# EAGLE design Porsche Quad Gauge (EAGLE 6.4)
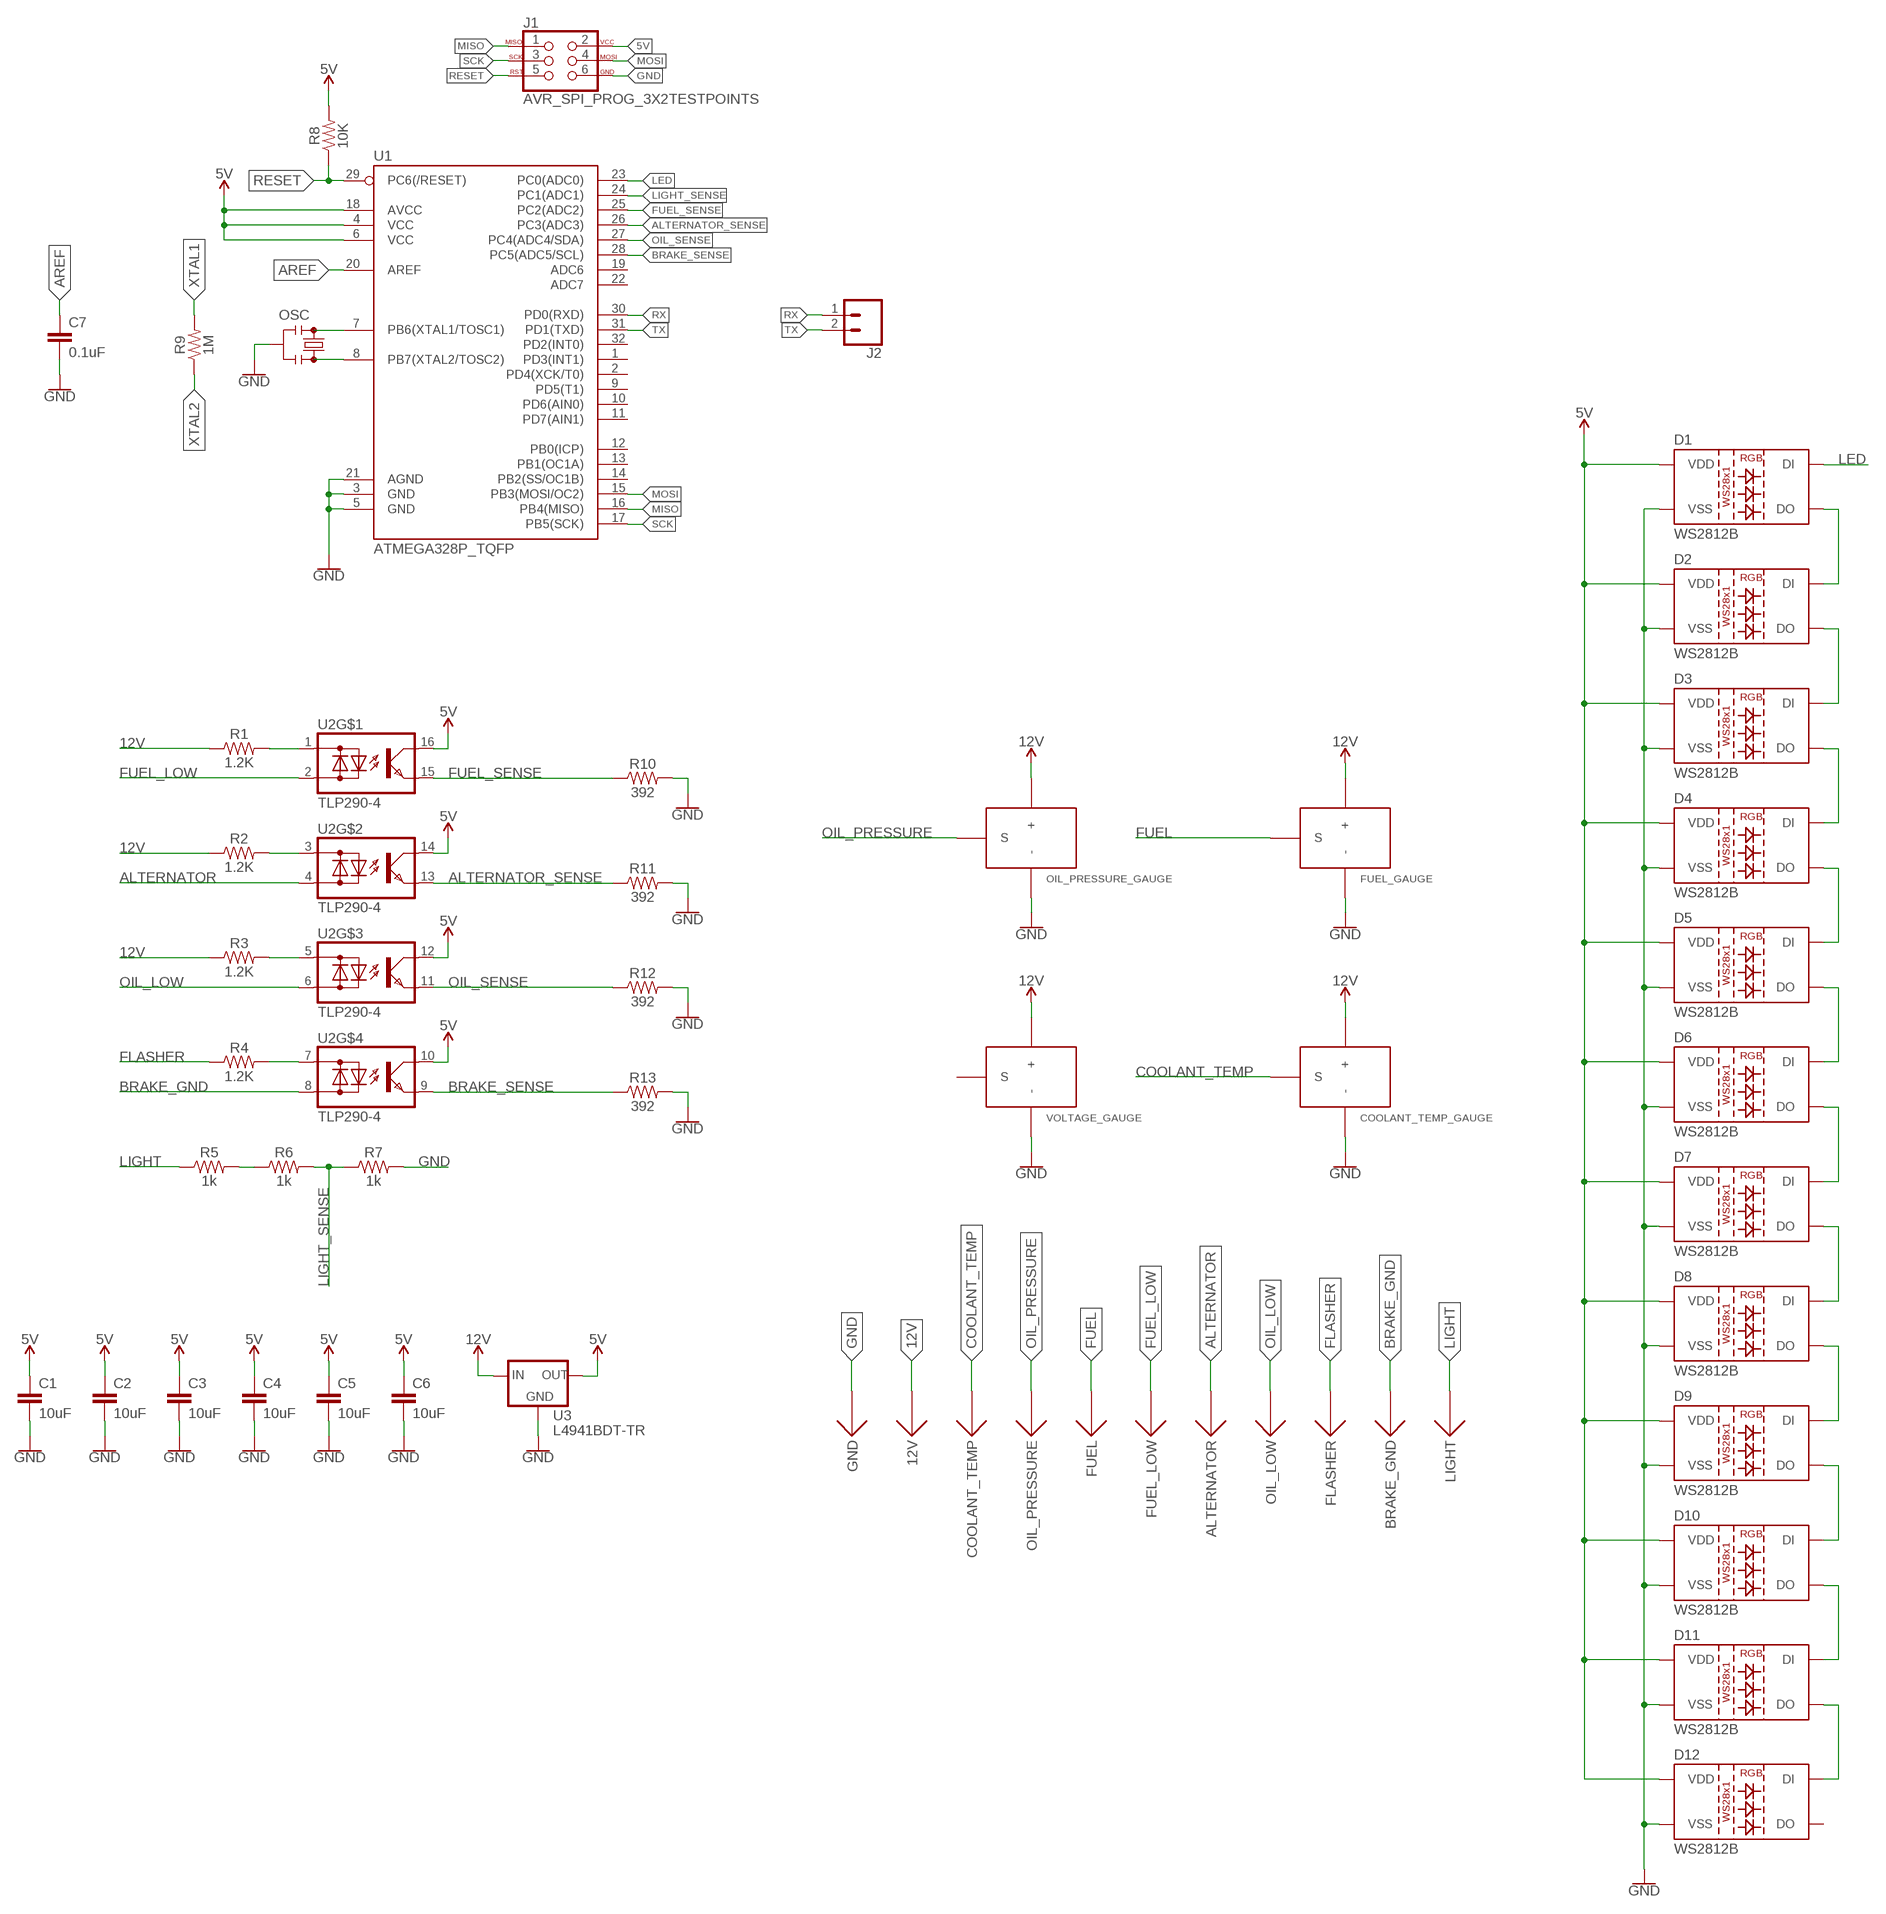
[diagram p0: schematic, sheet 1]

## Parts
12V  CONNECTOR_QC_TAB_0.25  [CONNECTOR_QC_TAB-0.25]
ALTERNATOR  CONNECTOR_QC_TAB_0.25  [CONNECTOR_QC_TAB-0.25]
BRAKE_GND  CONNECTOR_QC_TAB_0.25  [CONNECTOR_QC_TAB-0.25]
C1  10uF  10UF-0805-10V-10%  [0805]
C2  10uF  10UF-0805-10V-10%  [0805]
C3  10uF  10UF-0805-10V-10%  [0805]
C4  10uF  10UF-0805-10V-10%  [0805]
C5  10uF  10UF-0805-10V-10%  [0805]
C6  10uF  10UF-0805-10V-10%  [0805]
C7  0.1uF  10UF-0805-10V-10%  [0805]
COOLANT_TEMP  CONNECTOR_QC_TAB_0.25  [CONNECTOR_QC_TAB-0.25]
COOLANT_TEMP_GAUGE  VDO_OLD  [VDO_GAUGE_SOCKET]
D1  WS2812B  [WS2812B]
D2  WS2812B  [WS2812B]
D3  WS2812B  [WS2812B]
D4  WS2812B  [WS2812B]
D5  WS2812B  [WS2812B]
D6  WS2812B  [WS2812B]
D7  WS2812B  [WS2812B]
D8  WS2812B  [WS2812B]
D9  WS2812B  [WS2812B]
D10  WS2812B  [WS2812B]
D11  WS2812B  [WS2812B]
D12  WS2812B  [WS2812B]
FLASHER  CONNECTOR_QC_TAB_0.25  [CONNECTOR_QC_TAB-0.25]
FUEL  CONNECTOR_QC_TAB_0.25  [CONNECTOR_QC_TAB-0.25]
FUEL_GAUGE  VDO_OLD  [VDO_GAUGE_SOCKET]
FUEL_LOW  CONNECTOR_QC_TAB_0.25  [CONNECTOR_QC_TAB-0.25]
GND  CONNECTOR_QC_TAB_0.25  [CONNECTOR_QC_TAB-0.25]
J1  AVR_SPI_PROG_3X2TESTPOINTS  [2X3_TEST_POINTS]
J2  CONN_02  [1X02]
LIGHT  CONNECTOR_QC_TAB_0.25  [CONNECTOR_QC_TAB-0.25]
OIL_LOW  CONNECTOR_QC_TAB_0.25  [CONNECTOR_QC_TAB-0.25]
OIL_PRESSURE  CONNECTOR_QC_TAB_0.25  [CONNECTOR_QC_TAB-0.25]
OIL_PRESSURE_GAUGE  VDO_NEW  [VDO_NEW_GAUGE_SOCKET]
OSC  PRQC16.00SR1010V00L  [3-SMD]
R1  1.2K  RESISTOR0805  [0805]
R2  1.2K  RESISTOR0805  [0805]
R3  1.2K  RESISTOR0805  [0805]
R4  1.2K  RESISTOR0805  [0805]
R5  1k  RESISTOR0805  [0805]
R6  1k  RESISTOR0805  [0805]
R7  1k  RESISTOR0805  [0805]
R8  10K  RESISTOR0805  [0805]
R9  1M  RESISTOR0805  [0805]
R10  392  RESISTOR0805  [0805]
R11  392  RESISTOR0805  [0805]
R12  392  RESISTOR0805  [0805]
R13  392  RESISTOR0805  [0805]
U1  ATMEGA328P_TQFP  [TQFP32-08]
U2  TLP290-4  [SO16]
U3  L4941BDT-TR  [D-PAK_TO252AA]
VOLTAGE_GAUGE  VDO_NEW  [VDO_NEW_GAUGE_SOCKET]

## Nets
5V: C1.1 C2.1 C3.1 C4.1 C5.1 C6.1 D1.1(VDD) D2.1(VDD) D3.1(VDD) D4.1(VDD) D5.1(VDD) D6.1(VDD) D7.1(VDD) D8.1(VDD) D9.1(VDD) D10.1(VDD) D11.1(VDD) D12.1(VDD) J1.2 R8.2 U1.4(VCC) U1.6(VCC) U1.18(AVCC) U2.10(C) U2.12(C) U2.14(C) U2.16(C) U3.3(OUT)
12V: 12V.S1(SIGNAL) 12V.S2(SIGNAL) COOLANT_TEMP_GAUGE.12V(+) FUEL_GAUGE.12V(+) OIL_PRESSURE_GAUGE.12V(+) R1.1 R2.1 R3.1 U3.1(IN) VOLTAGE_GAUGE.12V(+)
ALTERNATOR: ALTERNATOR.S1(SIGNAL) ALTERNATOR.S2(SIGNAL) U2.4(AC2)
ALTERNATOR_SENSE: R11.1 U1.26(PC3(ADC3)) U2.13(E)
AREF: C7.1 U1.20(AREF)
BRAKE_GND: BRAKE_GND.S1(SIGNAL) BRAKE_GND.S2(SIGNAL) U2.8(AC2)
BRAKE_SENSE: R13.1 U1.28(PC5(ADC5/SCL)) U2.9(E)
COOLANT_TEMP: COOLANT_TEMP.S1(SIGNAL) COOLANT_TEMP.S2(SIGNAL) COOLANT_TEMP_GAUGE.SIGNAL(S)
FLASHER: FLASHER.S1(SIGNAL) FLASHER.S2(SIGNAL) R4.1
FUEL: FUEL.S1(SIGNAL) FUEL.S2(SIGNAL) FUEL_GAUGE.SIGNAL(S)
FUEL_LOW: FUEL_LOW.S1(SIGNAL) FUEL_LOW.S2(SIGNAL) U2.2(AC2)
FUEL_SENSE: R10.1 U1.25(PC2(ADC2)) U2.15(E)
GND: C1.2 C2.2 C3.2 C4.2 C5.2 C6.2 C7.2 COOLANT_TEMP_GAUGE.GND(-) D1.3(VSS) D2.3(VSS) D3.3(VSS) D4.3(VSS) D5.3(VSS) D6.3(VSS) D7.3(VSS) D8.3(VSS) D9.3(VSS) D10.3(VSS) D11.3(VSS) D12.3(VSS) FUEL_GAUGE.GND(-) GND.S1(SIGNAL) GND.S2(SIGNAL) J1.6 OIL_PRESSURE_GAUGE.GND(-) OSC.GND R7.2 R10.2 R11.2 R12.2 R13.2 U1.3(GND) U1.5(GND) U1.21(AGND) U3.2(GND) VOLTAGE_GAUGE.GND(-)
LED: D1.4(DI) U1.23(PC0(ADC0))
LIGHT: LIGHT.S1(SIGNAL) LIGHT.S2(SIGNAL) R5.1
LIGHT_SENSE: R6.2 R7.1 U1.24(PC1(ADC1))
MISO: J1.1 U1.16(PB4(MISO))
MOSI: J1.4 U1.15(PB3(MOSI/OC2))
N$1: R1.2 U2.1(AC1)
N$3: R5.2 R6.1
N$5: R2.2 U2.3(AC1)
N$8: D1.2(DO) D2.4(DI)
N$9: D2.2(DO) D3.4(DI)
N$10: D3.2(DO) D4.4(DI)
N$11: D4.2(DO) D5.4(DI)
N$12: D5.2(DO) D6.4(DI)
N$13: D6.2(DO) D7.4(DI)
N$14: D7.2(DO) D8.4(DI)
N$15: D8.2(DO) D9.4(DI)
N$16: D9.2(DO) D10.4(DI)
N$17: D10.2(DO) D11.4(DI)
N$18: D11.2(DO) D12.4(DI)
N$21: R3.2 U2.5(AC1)
N$22: R4.2 U2.7(AC1)
OIL_LOW: OIL_LOW.S1(SIGNAL) OIL_LOW.S2(SIGNAL) U2.6(AC2)
OIL_PRESSURE: OIL_PRESSURE.S1(SIGNAL) OIL_PRESSURE.S2(SIGNAL) OIL_PRESSURE_GAUGE.SIGNAL(S)
OIL_SENSE: R12.1 U1.27(PC4(ADC4/SDA)) U2.11(E)
RESET: J1.5 R8.1 U1.29(PC6(/RESET))
RX: J2.1 U1.30(PD0(RXD))
SCK: J1.3 U1.17(PB5(SCK))
TX: J2.2 U1.31(PD1(TXD))
XTAL1: OSC.XTAL1 R9.2 U1.7(PB6(XTAL1/TOSC1))
XTAL2: OSC.XTAL2 R9.1 U1.8(PB7(XTAL2/TOSC2))
Unconnected: D12.2(DO) U1.1(PD3(INT1)) U1.2(PD4(XCK/T0)) U1.9(PD5(T1)) U1.10(PD6(AIN0)) U1.11(PD7(AIN1)) U1.12(PB0(ICP)) U1.13(PB1(OC1A)) U1.14(PB2(SS/OC1B)) U1.19(ADC6) U1.22(ADC7) U1.32(PD2(INT0)) VOLTAGE_GAUGE.SIGNAL(S)

## Library data of the parts
12V ALTERNATOR BRAKE_GND COOLANT_TEMP FLASHER FUEL FUEL_LOW GND LIGHT OIL_LOW OIL_PRESSURE = Evan_Li_Custom:CONNECTOR_QC_TAB_0.25
C1-C6 = SparkFun-Capacitors:10UF: 10.0µF ceramic capacitors A capacitor is a passive two-terminal electrical component used to store electrical energy temporarily in an electric field.; PROD_ID: CAP-11330
C7 = SparkFun-Capacitors:10UF: 10.0µF ceramic capacitors A capacitor is a passive two-terminal electrical component used to store electrical energy temporarily in an electric field.; PROD_ID: CAP-11330; VALUE: 10uF
COOLANT_TEMP_GAUGE FUEL_GAUGE = Evan_Li_Custom:VDO_OLD
D1-D12 = Evan_Li_Custom:WS2812B: WS2812B SMD addressable RGB LED 5x5mm SMD LED with built-in controller IC. Color: Red/Green/Blue mC Rating: RGB: 390, 660, 180 mcd Forward Voltage: RGB: 2.0, 3.0, 3.0 V Packages:WS2812B SparkFun Products: Blynk Board - ESP8266 <https://www.sparkfun.com/products/13794>; PROD_ID: DIO-12503
J1 = SparkFun-Connectors:AVR_SPI_PROG_3X2: AVR ISP 6 Pin This is the reduced ISP connector for AVR programming. Common on Arduino. This footprint will take up less PCB space and can be used with a 10-pin to 6-pin adapter such as SKU: BOB-08508 **Special note about "TEST_POINT" package. The stop mask is on the top side, so if you want your programming test points to be on the bottom of your board, make sure to place this package on the bottom side of the board. This also ensure that the orientation to program from the bottom side will be correct. SparkFun Products: SparkFun ISP Pogo Adapter <https://www.sparkfun.com/products/11591> - NS Tiny AVR Programmer <https://www.sparkfun.com/products/11801> -PTH
J2 = SparkFun-Connectors:CONN_02: Multi connection point. Often used as Generic Header-pin footprint for 0.1 inch spaced/style header connections On any of the 0.1 inch spaced packages, you can populate with these: Break Away Headers - Straight <https://www.sparkfun.com/products/116> (PRT-00116) Break Away Male Headers - Right Angle <https://www.sparkfun.com/products/553> (PRT-00553) Female Headers <https://www.sparkfun.com/products/115> (PRT-00115) Break Away Headers - Machine Pin <https://www.sparkfun.com/products/117> (PRT-00117) Break Away Female Headers - Swiss Machine Pin <https://www.sparkfun.com/products/743> (PRT-00743) For SCREWTERMINALS and SPRING TERMINALS visit here: Screw Terimnals on SparkFun.com <https://www.sparkfun.com/search/results?term=Screw+Terminals> (5mm/3.5mm/2.54mm spacing) This device is also useful as a general connection point to wire up your design to another part of your project. Our various solder wires solder well into these plated through hole pads. Hook-Up Wire - Assortment (Stranded, 22 AWG) <https://www.sparkfun.com/products/11375> (PRT-11375) Hook-Up Wire - Assortment (Solid Core, 22 AWG) <https://www.sparkfun.com/products/11367> (PRT-11367) View the entire wire category on our website here <https://www.sparkfun.com/categories/141> Special notes: Molex polarized connector foot print use with: PRT-08233 with associated crimp pins and housings. 2.54_SCREWTERM for use with PRT-10571. 3.5mm Screw Terminal footprints for PRT-08084 5mm Screw Terminal footprints for use with PRT-08432
OIL_PRESSURE_GAUGE VOLTAGE_GAUGE = Evan_Li_Custom:VDO_NEW
OSC = Evan_Li_Custom:PRQC16.00SR1010V00L
R1-R13 = SparkFun-Resistors:RESISTOR: Generic Resistor Package
U1 = Evan_Li_Custom:ATMEGA328P_TQFP: Popular 328P in QFP Storefront component: ATmega328 - TQFP <https://www.sparkfun.com/products/13448> (COM-13448) Datasheet <http://www.sparkfun.com/datasheets/Components/SMD/ATMega328.pdf> SparkFun Products SparkFun RedBoard - Programmed with Arduino <https://www.sparkfun.com/products/12757> (DEV-12757) Arduino Pro Mini 328 - 5V/16MHz <https://www.sparkfun.com/products/11113> (DEV-11113) Arduino Pro Mini 328 - 3.3V/8MHz <https://www.sparkfun.com/products/11114> (DEV-11114) SparkFun OpenLog <https://www.sparkfun.com/products/13712> (DEV-13712) SparkFun MicroView - OLED Arduino Module <https://www.sparkfun.com/products/12923> (DEV-12923) SparkFun Digital Sandbox <https://www.sparkfun.com/products/12651> (DEV-12651) SparkFun PicoBoard <https://www.sparkfun.com/products/11888> (WIG-11888) Arduino Fio <https://www.sparkfun.com/products/10116> (DEV-10116) LilyPad Arduino 328 Main Board <https://www.sparkfun.com/products/13342> (DEV-13342) SparkFun RedStick <https://www.sparkfun.com/products/13741> (DEV-13741) LilyPad MP3 <https://www.sparkfun.com/products/11013> (DEV-11013) LilyPad Arduino SimpleSnap <https://www.sparkfun.com/products/10941> (DEV-10941) SparkFun Stepoko <https://www.sparkfun.com/products/13899> (ROB-13899) SparkFun Geiger Counter <https://www.sparkfun.com/products/11345> (SEN-11345) SparkFun EL Sequencer <https://www.sparkfun.com/products/12781> (COM-12781) Arduino Pro 328 - 5V/16MHz <https://www.sparkfun.com/products/10915> (DEV-10915) CryptoCape <https://www.sparkfun.com/products/12773> (DEV-12773) SparkFun IR Thermometer Evaluation Board - MLX90614 <https://www.sparkfun.com/products/10740> (SEN-10740) SparkFun RedBot Mainboard <https://www.sparkfun.com/products/12097> (ROB-12097) Arduino Pro 328 - 3.3V/8MHz <https://www.sparkfun.com/products/10914> (DEV-10914) SparkFun Block for Intel® Edison - Arduino <https://www.sparkfun.com/products/13036> (DEV-13036) SparkFun Simon Says - Surface Mount Soldering Kit <https://www.sparkfun.com/products/10935> (KIT-10935) SparkFun 7-Segment Serial Display - Red <https://www.sparkfun.com/products/11441> (COM-11441) SparkFun 7-Segment Serial Display - White <https://www.sparkfun.com/products/11629> (COM-11629) SparkFun 7-Segment Serial Display - Yellow <https://www.sparkfun.com/products/11443> (COM-11443) SparkFun 7-Segment Serial Display - Kelly Green <https://www.sparkfun.com/products/11440> (COM-11440) SparkFun 7-Segment Serial Display - Blue <https://www.sparkfun.com/products/11442> (COM-11442) SparkFun OpenSegment Serial Display - 20mm (Blue) <https://www.sparkfun.com/products/11647> (COM-11647) SparkFun OpenSegment Serial Display - 20mm (Green) <https://www.sparkfun.com/products/11646> (COM-11646) SparkFun OpenSegment Serial Display - 20mm (White) <https://www.sparkfun.com/products/11648> (COM-11648) SparkFun OpenSegment Serial Display - 20mm (Red) <https://www.sparkfun.com/products/11644> (COM-11644) SparkFun OpenSegment Serial Display - 20mm (Yellow) <https://www.sparkfun.com/products/11645> (COM-11645) SparkFun OpenSegment Shield <https://www.sparkfun.com/products/13190> (DEV-13190); PROD_ID: IC-09069
U2 = Evan_Li_Custom:TLP290-4
U3 = Evan_Li_Custom:L4941

## Board
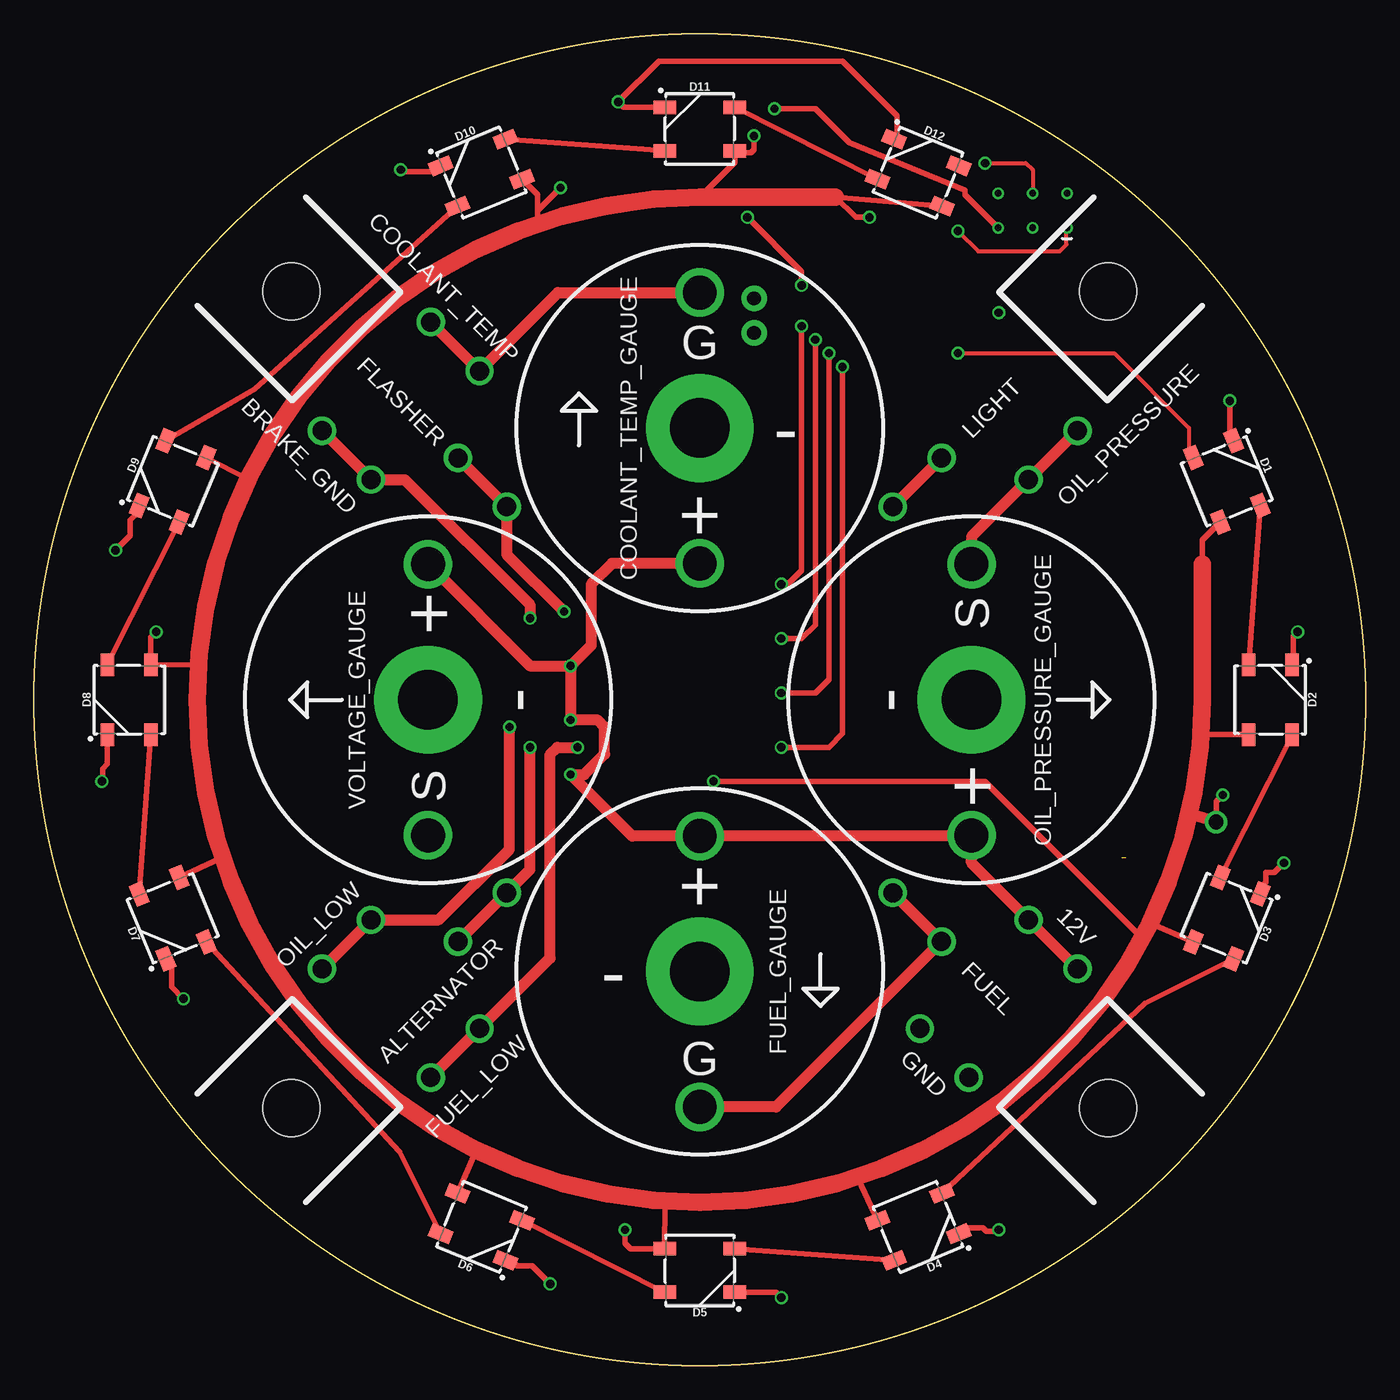
[diagram p1: board, top side]
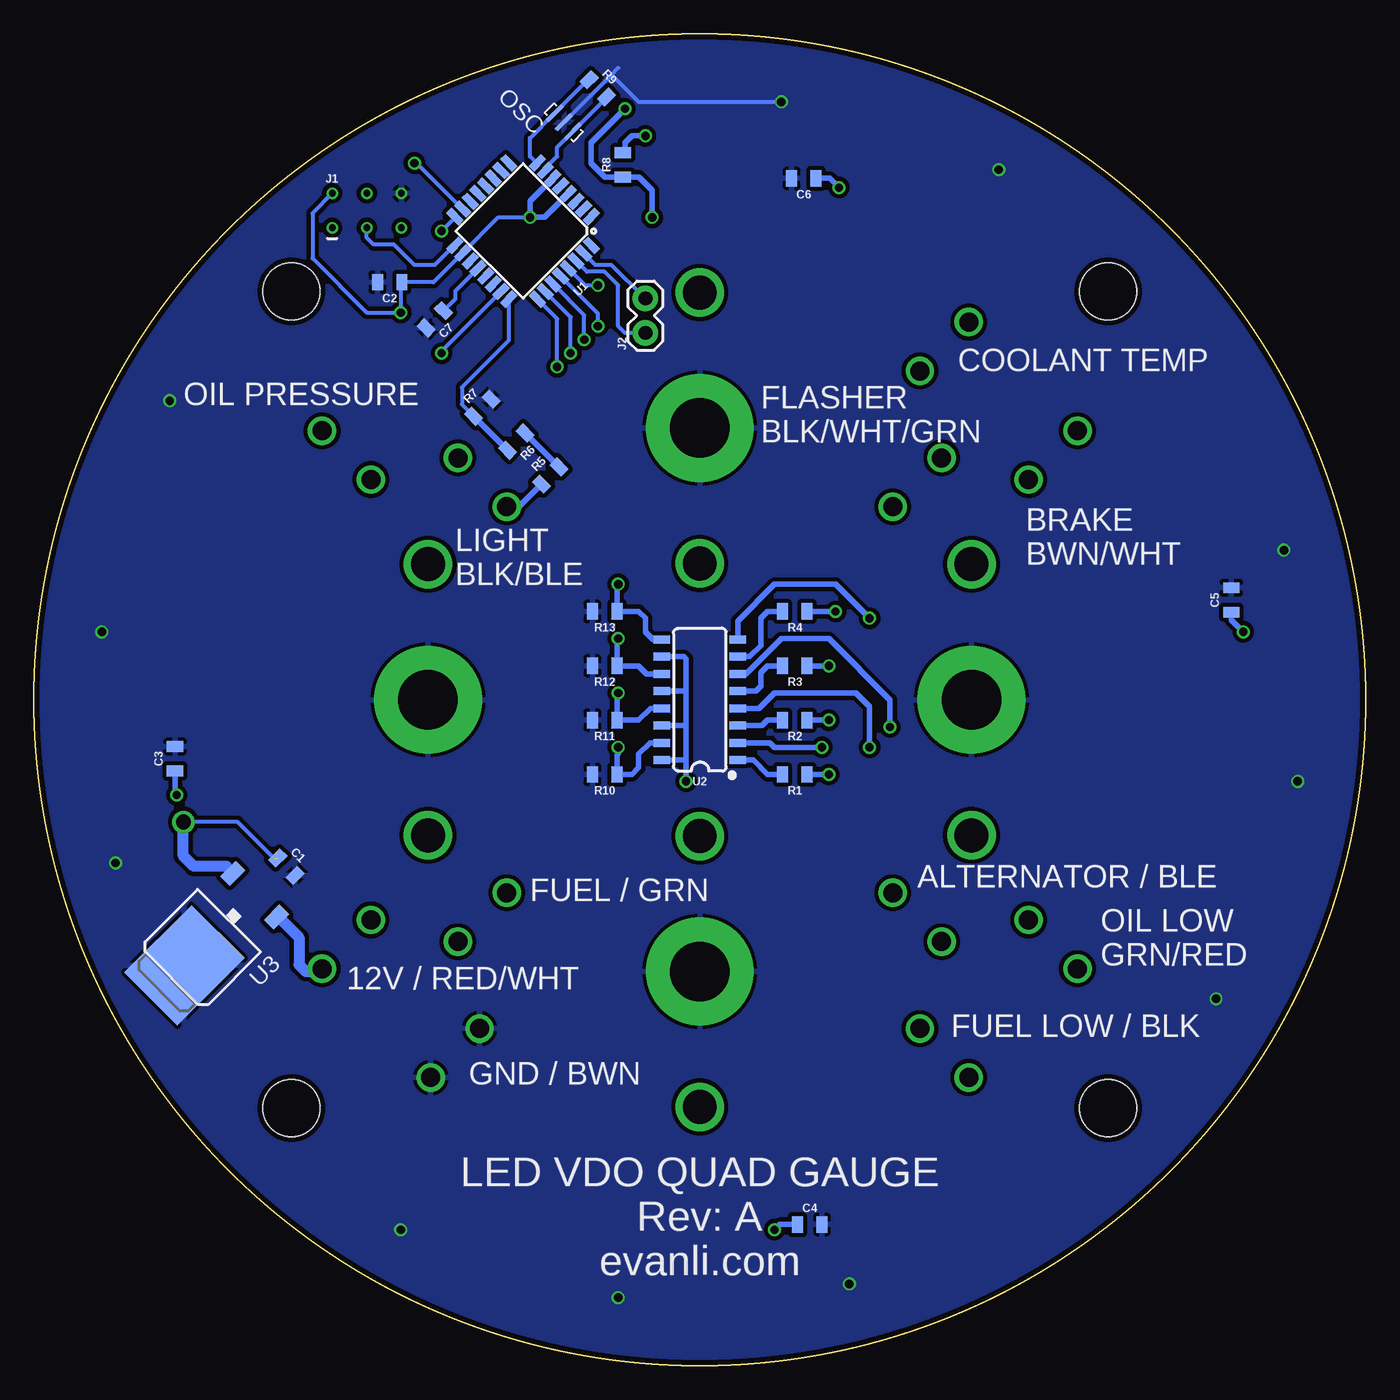
[diagram p2: board, bottom side, seen from below]

Size 98 x 98 mm. Coordinates in mm from the lower left corner, seen from the top.
Outline: circle at 49,49 radius 49
Copper layers (1*16): Top 0.0356mm / dielectric 1.5011mm / Bottom 0.0356mm
Design rules "LaenPCBOrder": minimum track width 6mil, minimum drill 13mil, track to track 6mil, track to pad 6mil, pad to pad 6mil, via to via 6mil, smd to smd 6mil, copper to edge 15mil, drill to drill 6mil, minimum pad ring 7mil, minimum via ring 7mil, stop-mask expansion 3mil, vias tented up to drill 0mil, thermal gap 10mil
Holes 4.2 mm at 79.05,18.95 18.95,18.95 18.95,79.05 79.05,79.05

### Footprints (pad centres in the part's own frame; a part is rotated, then mirrored left to right if it is on the bottom)
CONNECTOR_QC_TAB-0.25 = drill 1.397: S1 2.54,0; S2 -2.54,0
0805 = smd 0.8 x 1.2: 1 -0.9,0; 2 0.9,0
VDO_GAUGE_SOCKET = drill 2.499 pad 3.571: 12V 0,-9.97; SIGNAL 0,9.97 | drill 4.366 pad 7.938: GND 0,0
WS2812B = smd 1.651 x 1: 1 2.577,-1.6; 2 2.577,1.6; 3 -2.577,1.6; 4 -2.577,-1.6
2X3_TEST_POINTS = drill 0.508: 1 -2.54,-1.27; 2 -2.54,1.27; 3 0,-1.27; 4 0,1.27; 5 2.54,-1.27; 6 2.54,1.27
1X02 = drill 1.016 pad 1.88: 1 0,0; 2 2.54,0
VDO_NEW_GAUGE_SOCKET = drill 2.499 pad 3.571: 12V 9.97,0; SIGNAL -9.97,0 | drill 4.366 pad 7.938: GND 0,0
3-SMD = smd 0.3 x 1.6: GND 0,0; XTAL1 -0.95,0; XTAL2 0.95,0
TQFP32-08 = smd 1.27 x 0.559: 1 -4.293,2.8; 2 -4.293,2; 3 -4.293,1.2; 4 -4.293,0.4; 5 -4.293,-0.4; 6 -4.293,-1.2; 7 -4.293,-2; 8 -4.293,-2.8; 17 4.293,-2.8; 18 4.293,-2; 19 4.293,-1.2; 20 4.293,-0.4; 21 4.293,0.4; 22 4.293,1.2; 23 4.293,2; 24 4.293,2.8 | smd 0.559 x 1.27: 9 -2.8,-4.293; 10 -2,-4.293; 11 -1.2,-4.293; 12 -0.4,-4.293; 13 0.4,-4.293; 14 1.2,-4.293; 15 2,-4.293; 16 2.8,-4.293; 25 2.8,4.293; 26 2,4.293; 27 1.2,4.293; 28 0.4,4.293; 29 -0.4,4.293; 30 -1.2,4.293; 31 -2,4.293; 32 -2.8,4.293
SO16 = smd 0.6 x 1.2: 1 -4.445,-2.8; 2 -3.175,-2.8; 3 -1.905,-2.8; 4 -0.635,-2.8; 5 0.635,-2.8; 6 1.905,-2.8; 7 3.175,-2.8; 8 4.445,-2.8; 9 4.445,2.8; 10 3.175,2.8; 11 1.905,2.8; 12 0.635,2.8; 13 -0.635,2.8; 14 -1.905,2.8; 15 -3.175,2.8; 16 -4.445,2.8
D-PAK_TO252AA = smd 1 x 1.6: 1 -2.28,-4.8; 3 2.28,-4.8 | smd 5.5 x 7: 2 0,2.5

### Placement (x,y rotation side)
12V  75,31 315 top
ALTERNATOR  33,33 45 top
BRAKE_GND  23,67 315 top
C1  79.42,36.71 315 bottom
C2  71.82,79.73 180 bottom
C3  87.62,44.66 90 bottom
C4  40.9,10.38 0 bottom
C5  9.88,56.34 90 bottom
C6  41.34,87.37 180 bottom
C7  68.5,77 225 bottom
COOLANT_TEMP  31,75 315 top
COOLANT_TEMP_GAUGE  49,69 0 top
D1  87.8,65.07 292.5 top
D2  91,49 270 top
D3  87.8,32.93 247.5 top
D4  65.07,10.2 202.5 top
D5  49,7 180 top
D6  32.93,10.2 157.5 top
D7  10.2,32.93 112.5 top
D8  7,49 90 top
D9  10.2,65.07 67.5 top
D10  32.93,87.8 22.5 top
D11  49,91 0 top
D12  65.07,87.8 337.5 top
FLASHER  33,65 315 top
FUEL  65,33 315 top
FUEL_GAUGE  49,29 180 top
FUEL_LOW  31,23 45 top
GND  67,23 315 top
J1  73.5,85 0 bottom
J2  53,76 90 bottom
LIGHT  65,65 45 top
OIL_LOW  23,31 45 top
OIL_PRESSURE  75,67 45 top
OIL_PRESSURE_GAUGE  69,49 270 top
OSC  59,91.5 135 bottom
R1  42,43.5 180 bottom
R2  42,47.5 180 bottom
R3  42,51.5 180 bottom
R4  42,55.5 180 bottom
R5  60,65.5 45 bottom
R6  62.5,68 225 bottom
R7  65,70.5 45 bottom
R8  54.66,88.37 90 bottom
R9  56.5,94 315 bottom
R10  56,43.5 180 bottom
R11  56,47.5 180 bottom
R12  56,51.5 180 bottom
R13  56,55.5 180 bottom
U1  62,83.5 225 bottom
U2  49,49 90 bottom
U3  85.16,31.22 135 bottom
VOLTAGE_GAUGE  29,49 90 top

### Tracks (layer width: path | path; a pad name or v marks a point on that pad's centre or on a via)
5V  (via drill 0.6, 1.1)  (1 unrouted)
  Top 0.406: D1.1 86,60.77 86,59 | D2.1 89.36,46.46 86.08,46.46 | 86.08,46.46 86.08,48.49 86,48.58 86,49 | D10.1 37.06,86.17 37.06,85 | 37.06,85 37.06,84.05 49,86 51.58,88.58 D11.1 51.71,89.27 52.77,89.27 53,89.5 v53,90.5 | D12.1 59,86 60.5,84.5 v61.5,84.5 | 12.17,51.54 D8.1 8.6,53.6 v9,54 | 12.17,51.54 12,49 12.17,44.94 13.69,37.32 D7.1 | D9.1 15.73,65.26 12.68,57.13 12.17,51.54 | 46.46,11.92 D5.1 43.9,8.6 43.5,9 v43.5,10 | 46.46,11.92 49,12 49.51,11.92 54.84,12.42 60.68,13.69 D4.1 | D6.1 32.49,15.73 38.84,13.44 46.46,11.92 | D3.1 82.27,32.49 | 82.27,32.49 84.81,39.35 85.03,40.58 86.08,46.46 | 53.76,86.26 53.5,86 | v38.76,86.7 37.06,85 | v50,43 70,43 81.5,31.5 81.5,31.72 82.27,32.49 | v87,40 87,41.5 v87.5,42
  Top 0.813: v87,40 85.03,40.58
  Top 1.27: 86,59 86,49 arc-90 49,12 arc-90 12,49 arc-90 49,86 53.5,86 59,86
  Bottom 0.305: 80.35,37.35 83,40 v87,40 | v61.5,84.5 63.83,84.5 U1.18 68.6,79.73 C2.1 71,79.65 v71,77.5 73.5,77.5 77.5,81.5 77.5,84.81 J1.2
  Bottom 0.406: U2.10 50.17,52.17 50,52 50,49.5 | 50,49.5 50,47 | 50,47 50,44.5 | U2.12 50.13,49.63 50,49.5 | U2.14 50.09,47.09 50,47 | U2.16 50.05,44.55 50,44.5 | v50,43 50,44.5 | U1.4 60.43,84.5 v61.5,84.5 61.5,85.7 U1.6 | C6.1 39.43,87.37 v38.76,86.7 | C5.1 9.88,54.88 v9,54 | C4.1 43.12,10.38 v43.5,10 | C3.1 87.62,42.12 v87.5,42 | v53,90.5 54,90.5 54.5,90 54.5,89.43 R8.2
  Bottom 0.813: U3.3 83.38,36.27 83.85,36.74 86.24,36.74 87,37.5 v87,40
12V  (via drill 0.6)
  Top 0.813: VOLTAGE_GAUGE.12V 29.03,58.97 36.5,51.5 v39.5,51.5 | v39.5,51.5 v39.5,47.5 41.5,47.5 42,47 42,45 40.5,43.5 v39.5,43.5 44.03,38.97 FUEL_GAUGE.12V 68.94,38.97 OIL_PRESSURE_GAUGE.12V 69,37 12V.S2 12V.S1 | COOLANT_TEMP_GAUGE.12V 42.53,59.03 41,57.5 41,53 v39.5,51.5
  Bottom 0.406: R3.1 v39.5,51.5 | R2.1 v39.5,47.5 | R1.1 v39.5,43.5
  Bottom 0.813: U3.1 80,33 78.5,31.5 78.5,29.5 78,29 77,29 12V.S1
ALTERNATOR  (via drill 0.6)
  Top 0.813: ALTERNATOR.S2 ALTERNATOR.S1 36.5,36.5 v36.5,45.5
  Bottom 0.406: U2.4 44.63,48.37 43.5,49.5 37.5,49.5 36.5,48.5 v36.5,45.5
ALTERNATOR_SENSE  (via drill 0.6)
  Top 0.406: v55,49.5 57.5,49.5 58.5,50.5 v58.5,74.5
  Bottom 0.305: v58.5,74.5 58.5,77.17 U1.26
  Bottom 0.406: U2.13 52.63,48.37 53.5,47.5 R11.1 55.1,49.4 v55,49.5
AREF
  Bottom 0.305: U1.20 67,79.07 67,78.5 C7.1
BRAKE_GND  (via drill 0.6)
  Top 0.813: BRAKE_GND.S2 BRAKE_GND.S1 27.3,65.2 36.5,56 v36.5,55
  Bottom 0.406: U2.8 46.2,54.8 43.5,57.5 39,57.5 v36.5,55
BRAKE_SENSE  (via drill 0.6)
  Top 0.406: v55,57.5 55.5,57.5 56.5,58.5 v56.5,76.5
  Bottom 0.305: v56.5,76.5 56.5,77.43 U1.28
  Bottom 0.406: U2.9 52.45,53.45 53,54 53,55 53.5,55.5 R13.1 55.1,57.4 v55,57.5
COOLANT_TEMP
  Top 0.813: COOLANT_TEMP_GAUGE.SIGNAL 38.56,78.97 COOLANT_TEMP.S1 COOLANT_TEMP.S2
FLASHER  (via drill 0.6)
  Top 0.813: FLASHER.S2 FLASHER.S1 34.8,59.7 v39,55.5
  Bottom 0.406: R4.1 v39,55.5
FUEL
  Top 0.813: FUEL_GAUGE.SIGNAL 54.62,19.03 FUEL.S1 FUEL.S2
FUEL_LOW  (via drill 0.6)
  Top 0.813: FUEL_LOW.S2 FUEL_LOW.S1 38,30 38,45 38.5,45.5 v40,45.5
  Bottom 0.406: U2.2 43.83,45.83 43.5,45.5 v40,45.5
FUEL_SENSE  (via drill 0.6)
  Top 0.406: v55,45.5 58.5,45.5 59.5,46.5 v59.5,73.5
  Bottom 0.305: v59.5,73.5 59.5,77.04 U1.25
  Bottom 0.406: U2.15 52.67,45.83 53.5,45 53.5,44 54,43.5 R10.1 55.1,44.9 55,45 v55,45.5
GND  (via drill 0.6)
  Top 0.406: D1.3 88,68.06 v88,71 | D2.3 92.69,51.58 92.69,53.69 v93,54 | D3.3 90.26,35.15 90.66,35.54 90.66,36.3 91.3,36.3 v92,37 | D4.3 68.38,9.71 68.81,10.14 69.83,10.14 70.08,9.88 70.88,9.88 v71,10 | D5.3 54.6,5.4 v55,5 | D6.3 35.15,7.74 35.54,7.34 36.66,7.34 v38,6 | D7.3 9.71,29.62 10.14,29.19 10.14,27.86 v11,27 | D8.3 5.4,44.26 5.06,43.92 5.06,43.06 v5,43 | D9.3 7.74,62.85 7.09,62.21 7.09,61.09 v6,60 | D10.3 29.62,88.29 29.19,87.86 27.14,87.86 v27,88 | D11.3 43.4,92.6 v43,93 46,96 59.5,96 63.5,92 63.5,90.46 D12.3 62.85,90.26
  Bottom 0.305: 55.5,95 55,95.5 | OSC.GND 55.5,95 | 55.5,95 53.5,93 v43,93
  pour Bottom (isolate 0.305): 0,49 arc-90 49,98 arc-90 98,49 arc-90 49,0 arc-90
LED  (via drill 0.6)
  Top 0.305: v68,74.5 79.5,74.5 85,69 85,67.17 D1.4
  Bottom 0.305: v68,74.5 68,74.67 U1.23
LIGHT
  Top 0.813: LIGHT.S1 LIGHT.S2
  Bottom 0.406: LIGHT.S2 62.3,63.2 R5.1
LIGHT_SENSE
  Bottom 0.305: U1.24 63.05,75.44 66.5,72 66.5,70.73 R7.1
  Bottom 0.406: R6.2 R7.1
MISO  (via drill 0.6)
  Top 0.305: v68,83.5 69.5,82 75.5,82 76,82.5 76,83.69 J1.1
  Bottom 0.305: U1.16 67.02,84.48 v68,83.5
MOSI  (via drill 0.6)
  Top 0.305: v70,88.5 73,88.5 73.5,88 J1.4
  Bottom 0.305: U1.15 69.83,88.5 v70,88.5
N$1
  Bottom 0.406: U2.1 45.05,44.55 44,43.5 R1.2
N$3
  Bottom 0.406: R5.2 R6.1
N$5
  Bottom 0.406: U2.3 44.41,47.09 44,47.5 R2.2
N$8
  Top 0.406: D2.4 D1.2
N$9
  Top 0.406: D3.4 D2.2
N$10
  Top 0.406: D4.4 81.77,26.65 87.86,29.7 D3.2
N$11
  Top 0.406: D5.4 D4.2
N$12
  Top 0.406: D6.4 D5.2
N$13
  Top 0.406: D7.4 26.9,15.73 D6.2
N$14
  Top 0.406: D8.4 D7.2
N$15
  Top 0.406: D9.4 D8.2
N$16
  Top 0.406: D10.4 16.23,71.86 D9.2
N$17
  Top 0.406: D11.4 D10.2
N$18
  Top 0.406: D12.4 D11.2
N$21
  Bottom 0.406: U2.5 44.87,49.63 44.5,50 44.5,51 44,51.5 R3.2
N$22
  Bottom 0.406: U2.7 45.33,52.17 44.5,53 44.5,55 44,55.5 R4.2
OIL_LOW  (via drill 0.6)
  Top 0.813: OIL_LOW.S2 OIL_LOW.S1 29.8,32.8 35,38 v35,47
  Bottom 0.406: U2.6 45.59,50.91 43,53.5 39.5,53.5 35,49 v35,47
OIL_PRESSURE
  Top 0.813: OIL_PRESSURE_GAUGE.SIGNAL 69,61 OIL_PRESSURE.S2 OIL_PRESSURE.S1
OIL_SENSE  (via drill 0.6)
  Top 0.406: v55,53.5 56.5,53.5 57.5,54.5 v57.5,75.5
  Bottom 0.305: v57.5,75.5 57.5,77.3 U1.27
  Bottom 0.406: U2.11 52.91,50.91 53.5,51.5 R12.1 55.1,53.4 v55,53.5
RESET  (via drill 0.6)
  Top 0.406: J1.5 68.5,86.19 68.5,86.5 60,90 57.5,92.5 v54.5,92.5 | v52.5,84.5 56.5,80.5 v56.5,79.5
  Bottom 0.305: U1.29 57.43,79.5 v56.5,79.5
  Bottom 0.406: v54.5,92.5 57,90 57,88.5 55.97,87.47 R8.1 | R8.1 54.69,87.5 | R8.1 54.63,87.5 | v52.5,84.5 52.5,86.5 53.47,87.47 R8.1
RX
  Bottom 0.305: J2.1 54.5,76 55,76.5 55,79.5 56,80.5 57.3,80.5 U1.30
SCK
  Bottom 0.305: U1.17 67.06,82.44 68.5,81 70,81 71.5,82.5 73,82.5 73.5,83 J1.3
TX
  Bottom 0.305: J2.2 53.04,78.54 55.5,81 56.67,81 U1.31
XTAL1
  Bottom 0.305: U1.7 60.38,88.12 59.5,89 59.5,89.66 OSC.XTAL1 55.86,93.29 R9.2
XTAL2
  Bottom 0.305: U1.8 61.02,88.52 61.5,89 61.5,90.34 OSC.XTAL2 57.21,94.64 R9.1

### Text on the board
bNames: COOLANT TEMP | OIL PRESSURE | FLASHER / BLK/WHT/GRN | BRAKE / BWN/WHT | LIGHT / BLK/BLE | ALTERNATOR / BLE | FUEL / GRN | OIL LOW / GRN/RED | 12V / RED/WHT | FUEL LOW / BLK | GND / BWN | LED VDO QUAD GAUGE / Rev: A / evanli.com